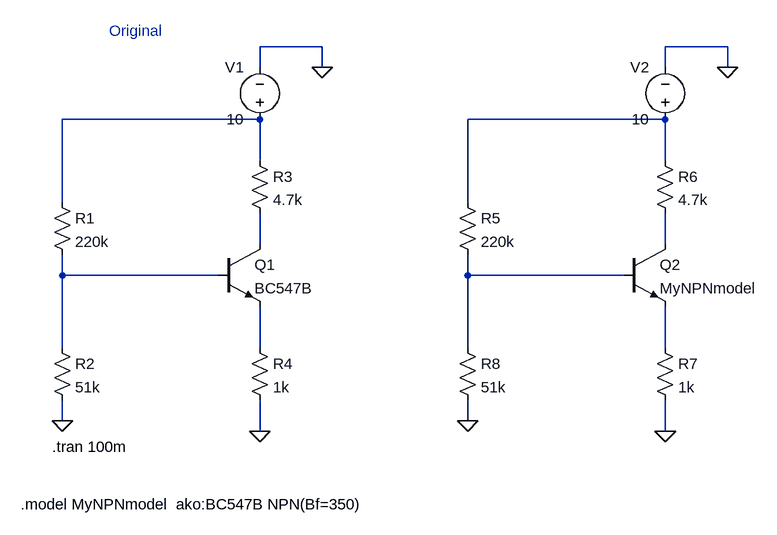
[diagram p0: schematic Lab3.2.asc]
Lab3.2.asc, the LTspice schematic file:
Version 4
SHEET 1 2708 680
WIRE 304 -240 208 -240
WIRE 928 -240 832 -240
WIRE 208 -208 208 -240
WIRE 304 -208 304 -240
WIRE 832 -208 832 -240
WIRE 928 -208 928 -240
WIRE 208 -128 -96 -128
WIRE 832 -128 528 -128
WIRE 208 -64 208 -128
WIRE 832 -64 832 -128
WIRE -96 0 -96 -128
WIRE 528 0 528 -128
WIRE 208 64 208 16
WIRE 832 64 832 16
WIRE -96 112 -96 80
WIRE 144 112 -96 112
WIRE 528 112 528 80
WIRE 768 112 528 112
WIRE -96 224 -96 112
WIRE 208 224 208 160
WIRE 528 224 528 112
WIRE 832 224 832 160
WIRE -96 336 -96 304
WIRE 528 336 528 304
WIRE 208 352 208 304
WIRE 832 352 832 304
FLAG 304 -208 0
FLAG 208 352 0
FLAG -96 336 0
FLAG 928 -208 0
FLAG 832 352 0
FLAG 528 336 0
SYMBOL res -112 -16 R0
SYMATTR InstName R1
SYMATTR Value 220k
SYMBOL npn 144 64 R0
SYMATTR InstName Q1
SYMATTR Value BC547B
SYMBOL res 192 -80 R0
SYMATTR InstName R3
SYMATTR Value 4.7k
SYMBOL res 192 208 R0
SYMATTR InstName R4
SYMATTR Value 1k
SYMBOL voltage 208 -112 R180
WINDOW 0 24 96 Left 2
WINDOW 3 24 16 Left 2
WINDOW 123 0 0 Left 0
WINDOW 39 0 0 Left 0
SYMATTR InstName V1
SYMATTR Value 10
SYMBOL res -112 208 R0
SYMATTR InstName R2
SYMATTR Value 51k
SYMBOL res 512 -16 R0
SYMATTR InstName R5
SYMATTR Value 220k
SYMBOL npn 768 64 R0
SYMATTR InstName Q2
SYMATTR Value MyNPNmodel
SYMBOL res 816 -80 R0
SYMATTR InstName R6
SYMATTR Value 4.7k
SYMBOL res 816 208 R0
SYMATTR InstName R7
SYMATTR Value 1k
SYMBOL voltage 832 -112 R180
WINDOW 0 24 96 Left 2
WINDOW 3 24 16 Left 2
WINDOW 123 0 0 Left 0
WINDOW 39 0 0 Left 0
SYMATTR InstName V2
SYMATTR Value 10
SYMBOL res 512 208 R0
SYMATTR InstName R8
SYMATTR Value 51k
TEXT -112 376 Left 2 !.tran 100m
TEXT -24 -264 Left 2 ;Original
TEXT -160 464 Left 2 !.model MyNPNmodel  ako:BC547B NPN(Bf=350)

The netlist it stands for:
* Lab3.2.asc
R1 N001 N005 220k
Q1 N003 N005 N007 0 BC547B
R3 N001 N003 4.7k
R4 N007 0 1k
V1 N001 0 10
R2 N005 0 51k
R5 N002 N006 220k
Q2 N004 N006 N008 0 MyNPNmodel
R6 N002 N004 4.7k
R7 N008 0 1k
V2 N002 0 10
R8 N006 0 51k
.model NPN NPN
.model PNP PNP
.lib standard.bjt
.tran 100m
* Original
.model MyNPNmodel  ako:BC547B NPN(Bf=350)
.backanno
.end